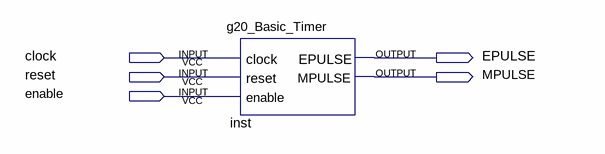
[diagram p0: schematic sheet]
// Quartus schematic Basic_Timer.bdf as structural Verilog: 1 symbols, 5 pins
module Basic_Timer (
  input  clock,
  input  reset,
  input  enable,
  output EPULSE,
  output MPULSE
);

  g20_Basic_Timer inst (.clock(clock), .reset(reset), .enable(enable), .EPULSE(EPULSE), .MPULSE(MPULSE));
endmodule
